# EasyEDA schematic SCH_MD001_2022-09-13.json
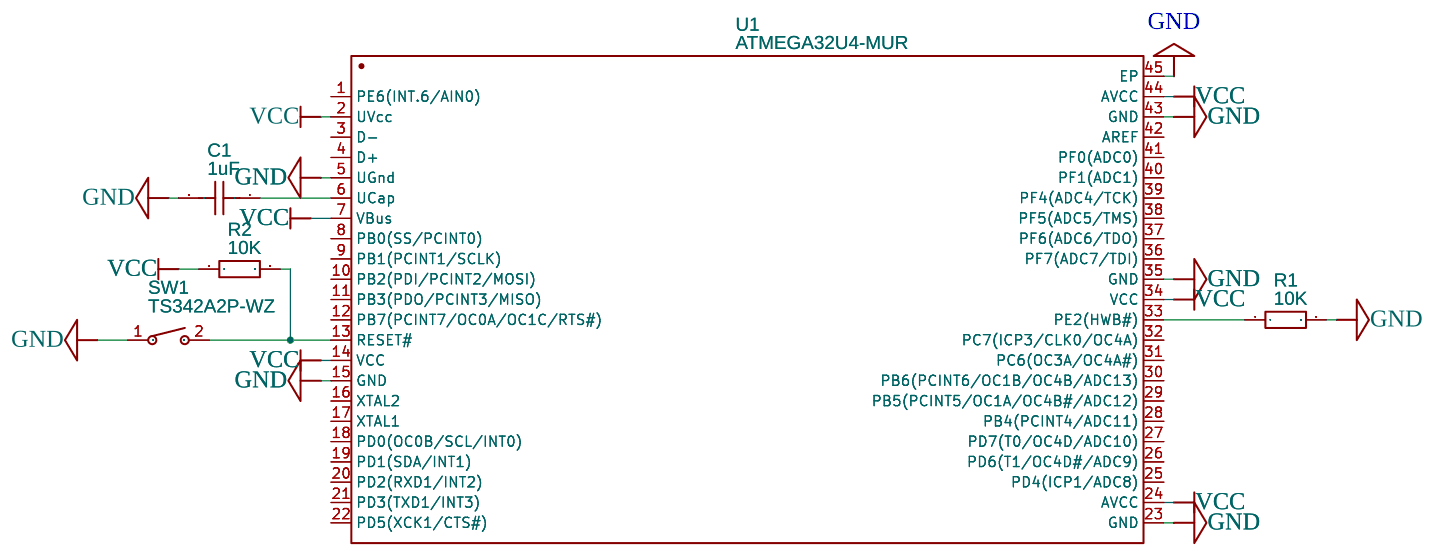
[diagram p0: schematic sheet]

## Parts
C1  1uF  [C0805]
R1  10K  [R0805]
R2  10K  [R0805]
SW1  TS342A2P-WZ  [SW-SMD_L4.0-W2.9-LS5.0]
U1  ATMEGA32U4-MUR  [VQFN-44_L7.0-W7.0-P0.50-BL-EP5.2]

## Library data of the parts
C1 = TCC0805X7R105K250DTS: Supplier: LCSC; Supplier Part: C344171; Manufacturer: CCTC; Contributor: LCSC; JLCPCB Part Class: Extended Part
R1 R2 = RT0805BRD0710KL: Supplier: LCSC; Manufacturer: YAGEO; Supplier Part: C110775; JLCPCB Part Class: Extended Part; Resistance: 10kΩ
SW1 = TS342A2P-WZ: Supplier: LCSC; Supplier Part: C557591; Manufacturer: SHOU HAN; Contributor: LCSC; JLCPCB Part Class: Extended Part
U1 = ATMEGA32U4-MUR: Contributor: KiCad; Supplier: LCSC; Manufacturer: MICROCHIP; Supplier Part: C45874; JLCPCB Part Class: Extended Part

## Nets
GND: C1.2 R1.2 SW1.1 U1.5(UGnd) U1.15(GND) U1.23(GND) U1.35(GND) U1.43(GND) U1.45(EP)
VCC: R2.1 U1.2(UVcc) U1.7(VBus) U1.14(VCC) U1.24(AVCC) U1.34(VCC) U1.44(AVCC)
Net-(C1-1): C1.1 U1.6(UCap)
Net-(R1-1): R1.1 U1.33(PE2(HWB#))
Net-(R2-2): R2.2 SW1.2 U1.13(RESET#)

Not connected (* = marked no-connect by the designer): U1 1(PE6(INT.6/AIN0)) 3(D-) 4(D+) 8(PB0(SS/PCINT0)) 9(PB1(PCINT1/SCLK)) 10(PB2(PDI/PCINT2/MOSI)) 11(PB3(PDO/PCINT3/MISO)) 12(PB7(PCINT7/OC0A/OC1C/RTS#)) 16(XTAL2) 17(XTAL1) 18(PD0(OC0B/SCL/INT0)) 19(PD1(SDA/INT1)) 20(PD2(RXD1/INT2)) 21(PD3(TXD1/INT3)) 22(PD5(XCK1/CTS#)) 25(PD4(ICP1/ADC8)) 26(PD6(T1/OC4D#/ADC9)) 27(PD7(T0/OC4D/ADC10)) 28(PB4(PCINT4/ADC11)) 29(PB5(PCINT5/OC1A/OC4B#/ADC12)) 30(PB6(PCINT6/OC1B/OC4B/ADC13)) 31(PC6(OC3A/OC4A#)) 32(PC7(ICP3/CLK0/OC4A)) 36(PF7(ADC7/TDI)) 37(PF6(ADC6/TDO)) 38(PF5(ADC5/TMS)) 39(PF4(ADC4/TCK)) 40(PF1(ADC1)) 41(PF0(ADC0)) 42(AREF)
